# Altium schematic sheet radio.SchDoc
size A3
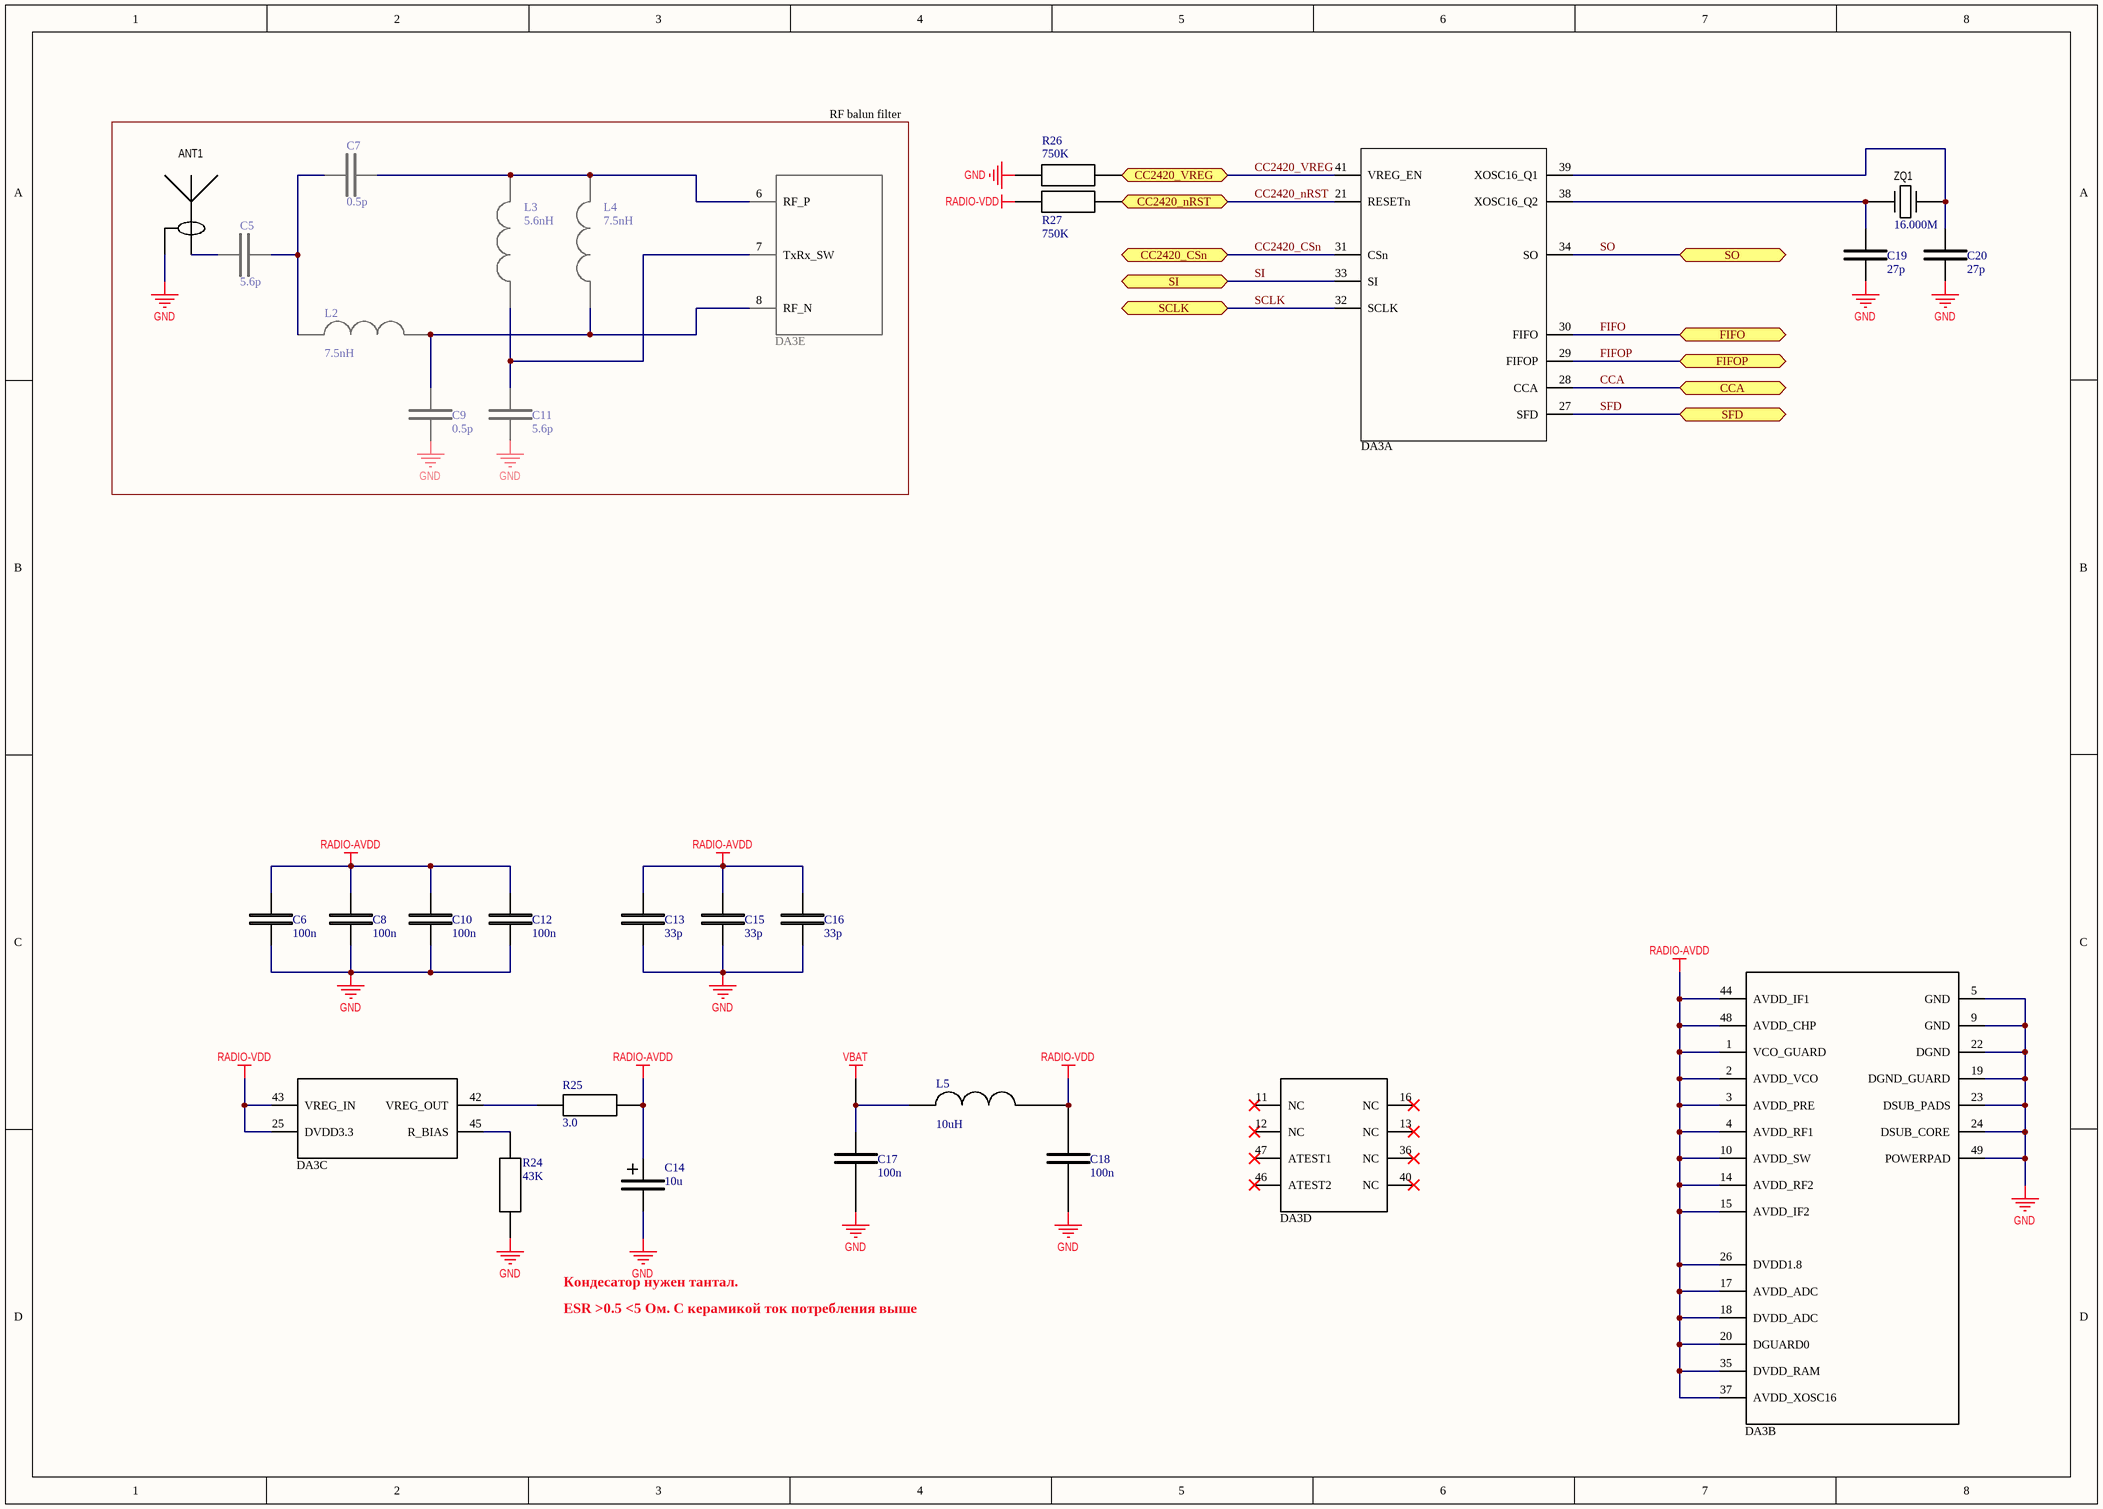
[diagram p0: radio.SchDoc]

## Parts
ANT1  PCB ANTENNA 2.4Ghz  [F-antena]  (value not drawn)
C5  5.6p  [CAP0402]
C6  100n  [CAP0402]
C7  0.5p  [CAP0402]
C8  100n  [CAP0402]
C9  0.5p  [CAP0402]
C10  100n  [CAP0402]
C11  5.6p  [CAP0402]
C12  100n  [CAP0402]
C13  33p  [CAP0402]
C14  10u  [CapSMDA]
C15  33p  [CAP0402]
C16  33p  [CAP0402]
C17  100n  [CAP0402]
C18  100n  [CAP0402]
C19  27p  [CAP0402]
C20  27p  [CAP0402]
DA3  CC2420  [QLP-48]  (value not drawn)  (parts A,B,C,D,E of 5)
L2  7.5nH  [IND0402]
L3  5.6nH  [IND0402]
L4  7.5nH  [IND0402]
L5  10uH  [IND0805]
R24  43K  [RES0402]
R25  3.0  [RES0402]
R26  750K  [RES0402]
R27  750K  [RES0402]
ZQ1  16.000M  [HC49SMD]

## Blocks framed on the sheet
RF balun filter: ANT1 C5 C7 C9 C11 DA3 L2-L4

## Ports
CC2420_CSn, CC2420_nRST, CC2420_VREG, CCA, FIFO, FIFOP, SCLK, SFD, SI, SO

## Nets
GND: ANT1.2 C6.2 C8.2 C9.2 C10.2 C11.2 C12.2 C13.2 C14.2 C15.2 C16.2 C17.2 C18.2 C19.2 C20.2 DA3.5(GND) DA3.9(GND) DA3.19(DGND_GUARD) DA3.22(DGND) DA3.23(DSUB_PADS) DA3.24(DSUB_CORE) DA3.49(POWERPAD) R24.1 R26.2
RADIO-AVDD: C6.1 C8.1 C10.1 C12.1 C13.1 C14.1 C15.1 C16.1 DA3.1(VCO_GUARD) DA3.2(AVDD_VCO) DA3.3(AVDD_PRE) DA3.4(AVDD_RF1) DA3.10(AVDD_SW) DA3.14(AVDD_RF2) DA3.15(AVDD_IF2) DA3.17(AVDD_ADC) DA3.18(DVDD_ADC) DA3.20(DGUARD0) DA3.26(DVDD1.8) DA3.35(DVDD_RAM) DA3.37(AVDD_XOSC16) DA3.44(AVDD_IF1) DA3.48(AVDD_CHP) R25.1
RADIO-VDD: C18.1 DA3.25(DVDD3.3) DA3.43(VREG_IN) L5.2 R27.2
VBAT: C17.1 L5.1
CC2420_CSn: DA3.31(CSn) ; port CC2420_CSn
CC2420_nRST: DA3.21(RESETn) R27.1 ; port CC2420_nRST
CC2420_VREG: DA3.41(VREG_EN) R26.1 ; port CC2420_VREG
CCA: DA3.28(CCA) ; port CCA
FIFO: DA3.30(FIFO) ; port FIFO
FIFOP: DA3.29(FIFOP) ; port FIFOP
SCLK: DA3.32(SCLK) ; port SCLK
SFD: DA3.27(SFD) ; port SFD
SI: DA3.33(SI) ; port SI
SO: DA3.34(SO) ; port SO
NetANT1_1: ANT1.1 C5.1
NetC5_2: C5.2 C7.1 L2.1
NetC7_2: C7.2 DA3.6(RF_P) L3.2 L4.2
NetC9_1: C9.1 DA3.8(RF_N) L2.2 L4.1
NetC11_1: C11.1 DA3.7(TxRx_SW) L3.1
NetC19_1: C19.1 DA3.38(XOSC16_Q2) ZQ1.2
NetC20_1: C20.1 DA3.39(XOSC16_Q1) ZQ1.1
NetDA3_42: DA3.42(VREG_OUT) R25.2
NetDA3_45: DA3.45(R_BIAS) R24.2

Not connected (* = marked no-connect by the designer): DA3 11(NC)* 12(NC)* 13(NC)* 16(NC)* 36(NC)* 40(NC)* 46(ATEST2)* 47(ATEST1)*

## Notes on the sheet
- Кондесатор нужен тантал.
- ESR >0.5 <5 Ом. С керамикой ток потребления выше

## Library data of the parts
ANT1 = PCB ANTENNA 2.4Ghz: PartNumber: PCB PRINT
C5 C11 = 5.6p SMD 0402: +/- 0.25pF NP0 SMD 0402; PartNumber: CC0402CRNPO9BN5R6; Manufacturer: Yageo; Supplier: Terraelectronica; Unit Price: 0.27; WebLink: https://www.terraelectronica.ru/product/980955
C6 C8 C10 C12 C17 C18 = 100n SMD 0402: 0402 SMD; PartNumber: CC0402ZRY5V7BB104; Manufacturer: Yageo; Supplier: Terraelectronica; Unit Price: 0.22; WebLink: https://www.terraelectronica.ru/product/543093
C7 C9 = 0.5p SMD 0402: +/- 0.25pF NP0 SMD 0402; PartNumber: GRM1555C1HR50BA01D; Manufacturer: Murata; Supplier: Terraelectronica; Unit Price: 0.69; WebLink: https://www.terraelectronica.ru/product/817877
C13 C15 C16 = 33p SMD 0402: 0402 SMD; PartNumber: CC0402JRNPO9BN330; Manufacturer: Yageo; Supplier: Terraelectronica; Unit Price: 0.24; WebLink: https://www.terraelectronica.ru/product/367363
C14 = 10u SMD TYPE A: SMD TYPE A; PartNumber: T491A106K010AT; Manufacturer: Kemet; Supplier: Terraelectronica; Unit Price: 5; WebLink: https://www.terraelectronica.ru/product/556976
C19 C20 = 27p SMD 0402: 0402 SMD; PartNumber: CL05C270JB5NNNC; Manufacturer: Samsung; Supplier: Terraelectronica; Unit Price: 0.24; WebLink: https://www.terraelectronica.ru/product/863257
DA3 = CC2420: 2.4 GHz transiver; PartNumber: CC2420RGZR; Manufacturer: Texas Instruments; Supplier: Terraelectronica; Unit Price: 439; WebLink: https://www.terraelectronica.ru/catalog/integralnye-mikroshemy-dlya-radiosvyazi-274?text=cc2420&search=cc2420
L2 L4 = IND 7.5nH SMD 0402: SMD 0402 5%; PartNumber: LQG15HS7N5J02D; Manufacturer: Murata; Supplier: Terraelectronica; Unit Price: 1.1; WebLink: https://www.terraelectronica.ru/product/574342
L3 = IND 5.6nH SMD 0402: SMD 0402 5%; PartNumber: LQG15HS5N6S02D; Manufacturer: Murata; Supplier: Terraelectronica; Unit Price: 1.1; WebLink: https://www.terraelectronica.ru/product/867408
L5 = IND 10uH SMD 0805: 0805 SMD; PartNumber: LQM21FN100M80L; Manufacturer: Murata; Supplier: Terraelectronica; Unit Price: 4.4; WebLink: https://www.terraelectronica.ru/product/1496283
R24 = 43K 1% SMD 0402: 1% 0402 SMD 0.063W; PartNumber: RC0402FR-0743KL; Manufacturer: Yageo; Supplier: Terraelectronica; Unit Price: 0.11; WebLink: https://www.terraelectronica.ru/product/870768
R25 = 3.0R 1% SMD 0402: 1% 0402 SMD 0.063W
R26 R27 = 750K 1% SMD 0402: 1% 0402 SMD 0.063W; PartNumber: RC0402FR-07750KL; Manufacturer: Yageo; Supplier: Terraelectronica; Unit Price: 0.1; WebLink: https://www.terraelectronica.ru/product/870851
ZQ1 = ZQ 16.000M 12pF 20ppm: Load 12pF 20ppm; PartNumber: 16.000MHzHC-49SM; Manufacturer: China; Supplier: Chipdip; Unit Price: 15; WebLink: https://www.chipdip.ru/product/16mhz-hc-49sm?from=suggest_product